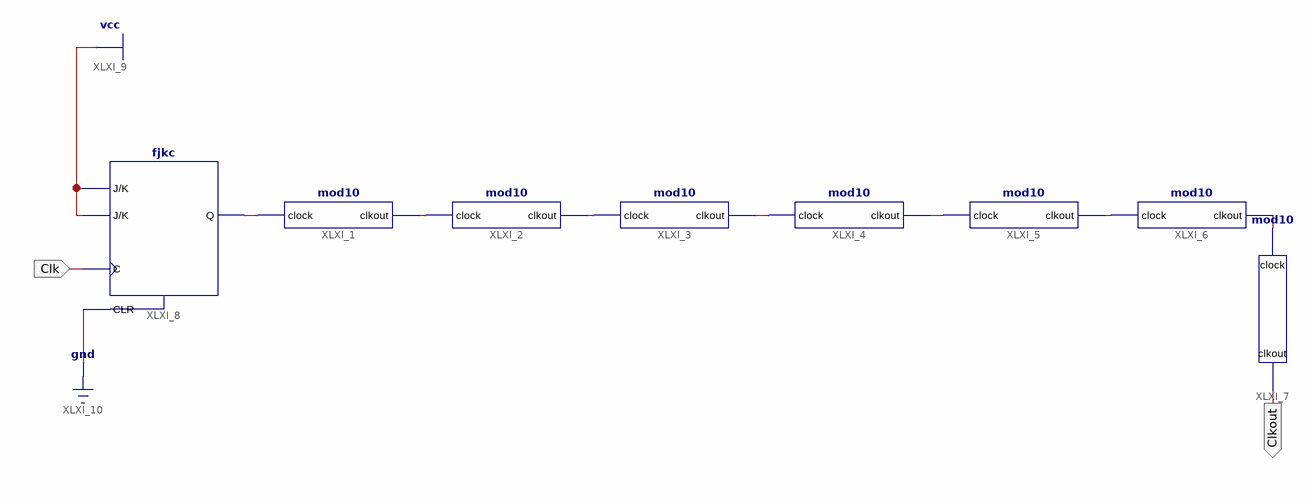
[diagram p0: schematic sheet 1]
// Xilinx ISE schematic mod20M.sch (spartan6) as structural Verilog: 8 symbols, 2 ports
module mod20M (
  input  Clk,
  output Clkout
);

  wire XLXN_1, XLXN_2, XLXN_3, XLXN_4, XLXN_5, XLXN_20, XLXN_21;

  mod10 XLXI_1 (.clkout(XLXN_20), .clock(XLXN_5));
  mod10 XLXI_2 (.clkout(XLXN_21), .clock(XLXN_20));
  mod10 XLXI_3 (.clkout(XLXN_1), .clock(XLXN_21));
  mod10 XLXI_4 (.clkout(XLXN_2), .clock(XLXN_1));
  mod10 XLXI_5 (.clkout(XLXN_4), .clock(XLXN_2));
  mod10 XLXI_7 (.clkout(Clkout), .clock(XLXN_3));
  mod10 XLXI_6 (.clkout(XLXN_3), .clock(XLXN_4));
  fjkc XLXI_8 (.C(Clk), .CLR(1'b0), .J(1'b1), .K(1'b1), .Q(XLXN_5));
endmodule
